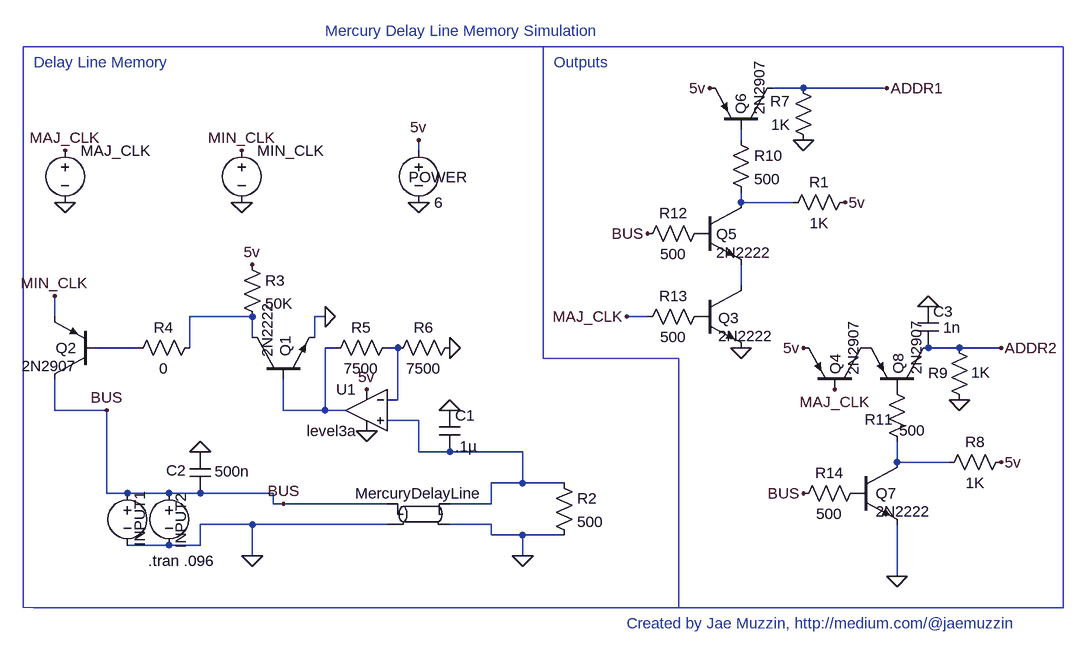
[diagram p0: schematic mercury_delay_line_addressing.asc]
mercury_delay_line_addressing.asc, the LTspice schematic file:
Version 4
SHEET 1 1732 680
WIRE 736 -432 688 -432
WIRE 864 -432 736 -432
WIRE 640 -352 640 -368
WIRE 144 -336 144 -352
WIRE 640 -256 640 -272
WIRE 720 -256 640 -256
WIRE 640 -128 640 -160
WIRE -416 -80 -416 -112
WIRE -112 -80 -208 -80
WIRE 0 -80 -16 -80
WIRE 496 -80 464 -80
WIRE -112 -48 -112 -80
WIRE -16 -48 -16 -80
WIRE -288 -32 -352 -32
WIRE -208 -32 -208 -80
WIRE 16 -32 0 -32
WIRE 112 -32 96 -32
WIRE 976 -32 928 -32
WIRE 1040 -32 976 -32
WIRE 112 48 112 -32
WIRE 112 48 96 48
WIRE -416 64 -416 16
WIRE -336 64 -416 64
WIRE -64 64 -64 16
WIRE 0 64 0 -32
WIRE 0 64 -64 64
WIRE 32 64 0 64
WIRE 144 80 96 80
WIRE 144 128 144 80
WIRE 192 128 144 128
WIRE 304 128 192 128
WIRE 880 144 880 112
WIRE 960 144 880 144
WIRE 304 176 304 128
WIRE 304 176 256 176
WIRE 368 176 304 176
WIRE -336 192 -336 64
WIRE -304 192 -336 192
WIRE -240 192 -304 192
WIRE -192 192 -240 192
WIRE -80 192 -192 192
WIRE -80 208 -80 192
WIRE -64 208 -80 208
WIRE 96 208 -64 208
WIRE 256 208 256 176
WIRE 256 208 192 208
WIRE -112 240 -192 240
WIRE 96 240 -112 240
WIRE 256 240 192 240
WIRE 256 256 256 240
WIRE 304 256 256 256
WIRE 368 256 304 256
WIRE -240 272 -304 272
WIRE -192 272 -192 240
WIRE -192 272 -240 272
WIRE -112 288 -112 240
WIRE 304 288 304 256
WIRE 880 320 880 240
FLAG 144 -352 5v
FLAG 144 -256 0
FLAG 64 96 0
FLAG 64 32 5v
FLAG 192 64 0
FLAG -128 -256 0
FLAG -112 288 0
FLAG 304 288 0
FLAG 0 -80 0
FLAG -112 -160 5v
FLAG 192 -32 0
FLAG -400 -256 0
FLAG -400 -336 MAJ_CLK
FLAG -336 64 BUS
FLAG 464 -80 MAJ_CLK
FLAG 496 -208 BUS
FLAG 864 -432 ADDR1
FLAG 640 -32 0
FLAG 592 -432 5v
FLAG 800 -256 5v
FLAG 736 -352 0
FLAG 784 32 MAJ_CLK
FLAG 736 192 BUS
FLAG 1040 -32 ADDR2
FLAG 736 -32 5v
FLAG 1040 144 5v
FLAG 976 48 0
FLAG 880 320 0
FLAG -128 -336 MIN_CLK
FLAG -192 128 0
FLAG 928 -96 0
FLAG -416 -112 MIN_CLK
FLAG -64 208 BUS
SYMBOL tline 144 224 R0
WINDOW 3 0 16 Invisible 2
SYMATTR Value Td=.016s Z0=500
SYMATTR InstName MercuryDelayLine
SYMBOL voltage -240 176 R0
WINDOW 0 18 101 VLeft 2
WINDOW 3 24 96 Invisible 2
WINDOW 123 0 0 Left 0
SYMATTR InstName INPUT2
SYMATTR Value PULSE(0 5 .011 0 0 .0005 .001 4)
SYMATTR SpiceLine Rser=100
SYMBOL res 352 160 R0
SYMATTR InstName R2
SYMATTR Value 500
SYMBOL voltage 144 -352 R0
WINDOW 0 -15 57 Left 2
WINDOW 123 0 0 Left 0
SYMATTR InstName POWER
SYMATTR Value 6
SYMATTR SpiceLine Rser=1
SYMBOL cap 176 64 R0
SYMATTR InstName C1
SYMATTR Value .1µ
SYMBOL OpAmps\\UniversalOpAmp3 64 64 M0
SYMATTR InstName U1
SYMBOL voltage -128 -352 R0
WINDOW 3 24 96 Invisible 2
WINDOW 123 0 0 Left 0
SYMATTR Value PULSE(0 6 0 0 0 .0005 .001)
SYMATTR InstName MIN_CLK
SYMATTR SpiceLine Rser=1
SYMBOL npn3 -112 16 R270
WINDOW 0 34 51 Left 2
WINDOW 3 34 23 Left 2
SYMATTR InstName Q1
SYMATTR Value 2N2222
SYMBOL pnp2 -352 16 R180
WINDOW 0 30 48 Left 2
WINDOW 3 30 20 Left 2
SYMATTR InstName Q2
SYMATTR Value 2N2907
SYMBOL res -128 -176 R0
SYMATTR InstName R3
SYMATTR Value 50K
SYMBOL res -192 -48 R90
WINDOW 0 0 56 VBottom 2
WINDOW 3 32 56 VTop 2
SYMATTR InstName R4
SYMATTR Value 0
SYMBOL res 112 -48 R90
WINDOW 0 0 56 VBottom 2
WINDOW 3 32 56 VTop 2
SYMATTR InstName R5
SYMATTR Value 7500
SYMBOL res 208 -48 R90
WINDOW 0 0 56 VBottom 2
WINDOW 3 32 56 VTop 2
SYMATTR InstName R6
SYMATTR Value 7500
SYMBOL voltage -304 176 R0
WINDOW 0 19 12 VRight 2
WINDOW 3 24 96 Invisible 2
WINDOW 123 0 0 Left 0
SYMATTR InstName INPUT1
SYMATTR Value PULSE(0 5 .003 0 0 .0005 .001 3)
SYMATTR SpiceLine Rser=100
SYMBOL voltage -400 -352 R0
WINDOW 3 24 96 Invisible 2
WINDOW 123 0 0 Left 0
SYMATTR Value PULSE(0 6 0 .00000001 .00000001 .008 .016)
SYMATTR InstName MAJ_CLK
SYMATTR SpiceLine Rser=1
SYMBOL npn3 576 -128 R0
WINDOW 0 29 50 Left 2
WINDOW 3 29 78 Left 2
SYMATTR InstName Q3
SYMATTR Value 2N2222
SYMBOL npn3 576 -256 R0
WINDOW 0 26 49 Left 2
WINDOW 3 26 77 Left 2
SYMATTR InstName Q5
SYMATTR Value 2N2222
SYMBOL pnp2 688 -368 M270
WINDOW 0 23 48 Left 2
WINDOW 3 23 20 Left 2
SYMATTR InstName Q6
SYMATTR Value 2N2907
SYMBOL res 816 -272 R90
WINDOW 0 0 56 VBottom 2
WINDOW 3 32 56 VTop 2
SYMATTR InstName R1
SYMATTR Value 1K
SYMBOL res 752 -336 R180
WINDOW 0 36 76 Left 2
WINDOW 3 36 40 Left 2
SYMATTR InstName R7
SYMATTR Value 1K
SYMBOL npn3 816 144 R0
WINDOW 0 31 48 Left 2
WINDOW 3 31 76 Left 2
SYMATTR InstName Q7
SYMATTR Value 2N2222
SYMBOL pnp2 928 32 M270
WINDOW 0 23 46 Left 2
WINDOW 3 23 18 Left 2
SYMATTR InstName Q8
SYMATTR Value 2N2907
SYMBOL res 1056 128 R90
WINDOW 0 0 56 VBottom 2
WINDOW 3 32 56 VTop 2
SYMATTR InstName R8
SYMATTR Value 1K
SYMBOL res 992 64 R180
WINDOW 0 33 57 Left 2
WINDOW 3 -31 58 Left 2
SYMATTR InstName R9
SYMATTR Value 1K
SYMBOL pnp2 832 32 M270
WINDOW 0 22 47 Left 2
WINDOW 3 22 19 Left 2
SYMATTR InstName Q4
SYMATTR Value 2N2907
SYMBOL res 624 -368 R0
SYMATTR InstName R10
SYMATTR Value 500
SYMBOL res 864 16 R0
WINDOW 0 -34 62 Left 2
WINDOW 3 19 79 Left 2
SYMATTR InstName R11
SYMATTR Value 500
SYMBOL res 592 -224 R90
WINDOW 0 0 56 VBottom 2
WINDOW 3 32 56 VTop 2
SYMATTR InstName R12
SYMATTR Value 500
SYMBOL res 592 -96 R90
WINDOW 0 0 56 VBottom 2
WINDOW 3 32 56 VTop 2
SYMATTR InstName R13
SYMATTR Value 500
SYMBOL res 832 176 R90
WINDOW 0 0 56 VBottom 2
WINDOW 3 32 56 VTop 2
SYMATTR InstName R14
SYMATTR Value 500
SYMBOL cap -208 128 R0
WINDOW 0 -36 29 Left 2
WINDOW 3 38 30 Left 2
SYMATTR InstName C2
SYMATTR Value 500n
SYMBOL cap 912 -96 R0
WINDOW 3 39 33 Left 2
SYMATTR InstName C3
SYMATTR Value 1n
TEXT -272 296 Left 2 !.tran .096
TEXT 352 -472 Left 2 ;Outputs
TEXT -448 -472 Left 2 ;Delay Line Memory
TEXT 0 -520 Left 2 ;Mercury Delay Line Memory Simulation
TEXT 464 392 Left 2 ;Created by Jae Muzzin, http://medium.com/@jaemuzzin
LINE Normal 544 -16 336 -16
LINE Normal 544 368 544 -16
LINE Normal 1136 368 544 368
LINE Normal 1136 -496 1136 368
LINE Normal 336 -496 1136 -496
LINE Normal 336 -16 336 -496
LINE Normal -464 -496 336 -496
LINE Normal 544 368 544 368 2
LINE Normal -448 368 544 368
LINE Normal -464 -496 -464 -496 2
LINE Normal -464 368 -464 -496
LINE Normal -448 368 -464 368 2

The netlist it stands for:
* mercury_delay_line_addressing.asc
T§MercuryDelayLine BUS 0 N008 0 Td=.016s Z0=500
V§INPUT2 BUS 0 PULSE(0 5 .011 0 0 .0005 .001 4) Rser=100
R2 N008 0 500
V§POWER 5v 0 6 Rser=1
C1 0 N008 .1µ
XU1 N008 N007 5v 0 N006 level3a  ; pins In+ In- V+ V- OUT
V§MIN_CLK MIN_CLK 0 PULSE(0 6 0 0 0 .0005 .001) Rser=1
Q1 N004 N006 0 0 2N2222
Q2 BUS N005 MIN_CLK 0 2N2907
R3 5v N004 50K
R4 N004 N005 0
R5 N007 N006 7500
R6 0 N007 7500
V§INPUT1 BUS 0 PULSE(0 5 .003 0 0 .0005 .001 3) Rser=100
V§MAJ_CLK MAJ_CLK 0 PULSE(0 6 0 .00000001 .00000001 .008 .016) Rser=1
Q3 N003 P001 0 0 2N2222
Q5 N002 P002 N003 0 2N2222
Q6 ADDR1 N001 5v 0 2N2907
R1 5v N002 1K
R7 0 ADDR1 1K
Q7 N009 P003 0 0 2N2222
Q8 ADDR2 P004 P005 0 2N2907
R8 5v N009 1K
R9 0 ADDR2 1K
Q4 P005 MAJ_CLK 5v 0 2N2907
R10 N001 N002 500
R11 P004 N009 500
R12 P002 BUS 500
R13 P001 MAJ_CLK 500
R14 P003 BUS 500
C2 0 BUS 500n
C3 0 ADDR2 1n
.model NPN NPN
.model PNP PNP
.lib standard.bjt
.tran .096
* Outputs
* Delay Line Memory
* Mercury Delay Line Memory Simulation
* Created by Jae Muzzin, http://medium.com/@jaemuzzin
.backanno
.end